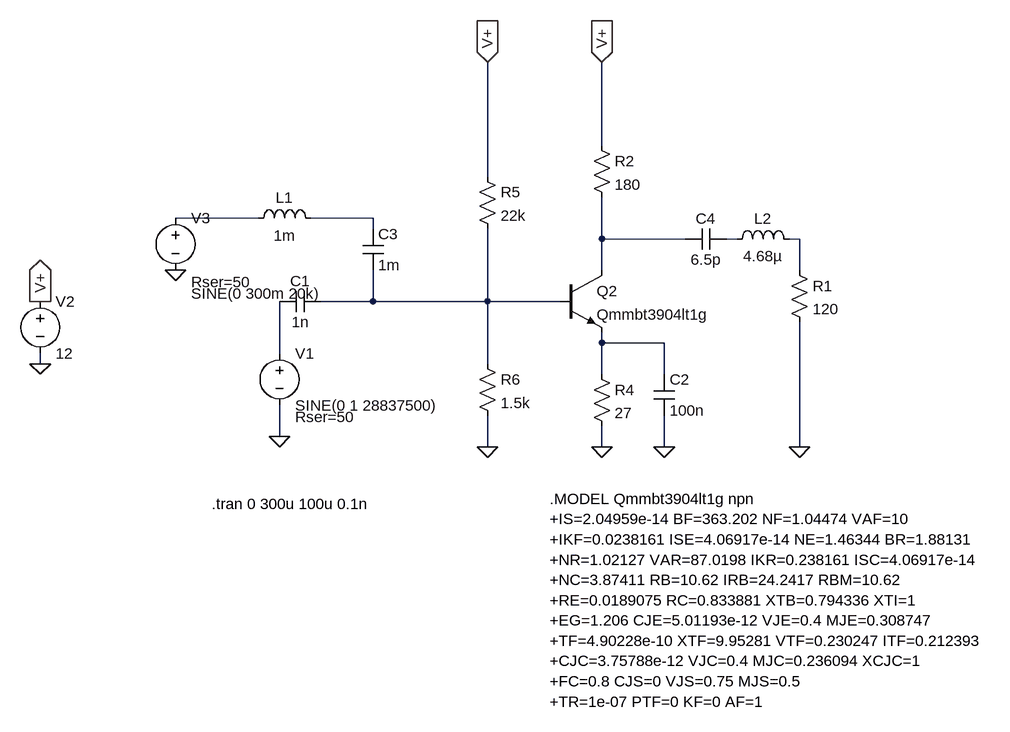
[diagram p0: schematic Mixer.asc]
Mixer.asc, the LTspice schematic file:
Version 4
SHEET 1 2992 1448
WIRE 1520 64 1520 -64
WIRE 1344 112 1344 -64
WIRE 992 176 864 176
WIRE 1168 176 1072 176
WIRE 1168 192 1168 176
WIRE 1520 208 1520 144
WIRE 1648 208 1520 208
WIRE 1728 208 1712 208
WIRE 1824 208 1808 208
WIRE 1520 256 1520 208
WIRE 1824 256 1824 208
WIRE 1168 304 1168 256
WIRE 1168 304 1088 304
WIRE 1344 304 1344 192
WIRE 1344 304 1168 304
WIRE 1456 304 1344 304
WIRE 1520 368 1520 352
WIRE 1616 368 1520 368
WIRE 1024 384 1024 304
WIRE 656 400 656 384
WIRE 1344 400 1344 304
WIRE 1520 416 1520 368
WIRE 1616 416 1616 368
WIRE 1024 512 1024 464
WIRE 1344 528 1344 480
WIRE 1520 528 1520 496
WIRE 1616 528 1616 480
WIRE 1824 528 1824 336
FLAG 1344 528 0
FLAG 656 400 0
FLAG 1520 528 0
FLAG 1616 528 0
FLAG 1824 528 0
FLAG 656 304 V+
IOPIN 656 304 Out
FLAG 1344 -64 V+
IOPIN 1344 -64 In
FLAG 1520 -64 V+
IOPIN 1520 -64 In
FLAG 1024 512 0
FLAG 864 256 0
SYMBOL npn 1456 256 R0
SYMATTR InstName Q2
SYMATTR Value Qmmbt3904lt1g
SYMBOL res 1504 400 R0
SYMATTR InstName R4
SYMATTR Value 27
SYMBOL res 1328 96 R0
SYMATTR InstName R5
SYMATTR Value 22k
SYMBOL res 1328 384 R0
SYMATTR InstName R6
SYMATTR Value 1.5k
SYMBOL voltage 656 288 R0
WINDOW 123 0 0 Left 0
WINDOW 39 0 0 Left 0
SYMATTR InstName V2
SYMATTR Value 12
SYMBOL cap 1600 416 R0
SYMATTR InstName C2
SYMATTR Value 100n
SYMBOL res 1808 240 R0
SYMATTR InstName R1
SYMATTR Value 120
SYMBOL voltage 1024 368 R0
WINDOW 123 0 0 Left 0
WINDOW 39 24 114 Left 2
SYMATTR SpiceLine Rser=50
SYMATTR InstName V1
SYMATTR Value SINE(0 1 28837500)
SYMBOL res 1504 48 R0
SYMATTR InstName R2
SYMATTR Value 180
SYMBOL cap 1088 288 R90
WINDOW 0 0 32 VBottom 2
WINDOW 3 32 32 VTop 2
SYMATTR InstName C1
SYMATTR Value 1n
SYMBOL voltage 864 160 R0
WINDOW 3 24 132 Left 2
WINDOW 123 0 0 Left 0
WINDOW 39 24 114 Left 2
SYMATTR Value SINE(0 300m 20k)
SYMATTR SpiceLine Rser=50
SYMATTR InstName V3
SYMBOL cap 1152 192 R0
SYMATTR InstName C3
SYMATTR Value 1m
SYMBOL ind 976 192 R270
WINDOW 0 32 56 VTop 2
WINDOW 3 5 56 VBottom 2
SYMATTR InstName L1
SYMATTR Value 1m
SYMBOL cap 1712 192 R90
WINDOW 0 0 32 VBottom 2
WINDOW 3 32 32 VTop 2
SYMATTR InstName C4
SYMATTR Value 6.5p
SYMBOL ind 1712 224 R270
WINDOW 0 32 56 VTop 2
WINDOW 3 5 56 VBottom 2
SYMATTR InstName L2
SYMATTR Value 4.68µ
TEXT 920 616 Left 2 !.tran 0 300u 100u 0.1n
TEXT 1440 608 Left 2 !.MODEL Qmmbt3904lt1g npn\n+IS=2.04959e-14 BF=363.202 NF=1.04474 VAF=10\n+IKF=0.0238161 ISE=4.06917e-14 NE=1.46344 BR=1.88131\n+NR=1.02127 VAR=87.0198 IKR=0.238161 ISC=4.06917e-14\n+NC=3.87411 RB=10.62 IRB=24.2417 RBM=10.62\n+RE=0.0189075 RC=0.833881 XTB=0.794336 XTI=1\n+EG=1.206 CJE=5.01193e-12 VJE=0.4 MJE=0.308747\n+TF=4.90228e-10 XTF=9.95281 VTF=0.230247 ITF=0.212393\n+CJC=3.75788e-12 VJC=0.4 MJC=0.236094 XCJC=1\n+FC=0.8 CJS=0 VJS=0.75 MJS=0.5\n+TR=1e-07 PTF=0 KF=0 AF=1

The netlist it stands for:
* Mixer.asc
Q2 N003 N006 N007 0 Qmmbt3904lt1g
R4 N007 0 27
R5 V+ N006 22k
R6 N006 0 1.5k
V2 V+ 0 12
C2 N007 0 100n
R1 N005 0 120
V1 N008 0 SINE(0 1 28837500) Rser=50
R2 V+ N003 180
C1 N006 N008 1n
V3 N001 0 SINE(0 300m 20k) Rser=50
C3 N002 N006 1m
L1 N001 N002 1m
C4 N004 N003 6.5p
L2 N004 N005 4.68µ
.model NPN NPN
.model PNP PNP
.lib standard.bjt
.tran 0 300u 100u 0.1n
.MODEL Qmmbt3904lt1g npn
+IS=2.04959e-14 BF=363.202 NF=1.04474 VAF=10
+IKF=0.0238161 ISE=4.06917e-14 NE=1.46344 BR=1.88131
+NR=1.02127 VAR=87.0198 IKR=0.238161 ISC=4.06917e-14
+NC=3.87411 RB=10.62 IRB=24.2417 RBM=10.62
+RE=0.0189075 RC=0.833881 XTB=0.794336 XTI=1
+EG=1.206 CJE=5.01193e-12 VJE=0.4 MJE=0.308747
+TF=4.90228e-10 XTF=9.95281 VTF=0.230247 ITF=0.212393
+CJC=3.75788e-12 VJC=0.4 MJC=0.236094 XCJC=1
+FC=0.8 CJS=0 VJS=0.75 MJS=0.5
+TR=1e-07 PTF=0 KF=0 AF=1
.backanno
.end